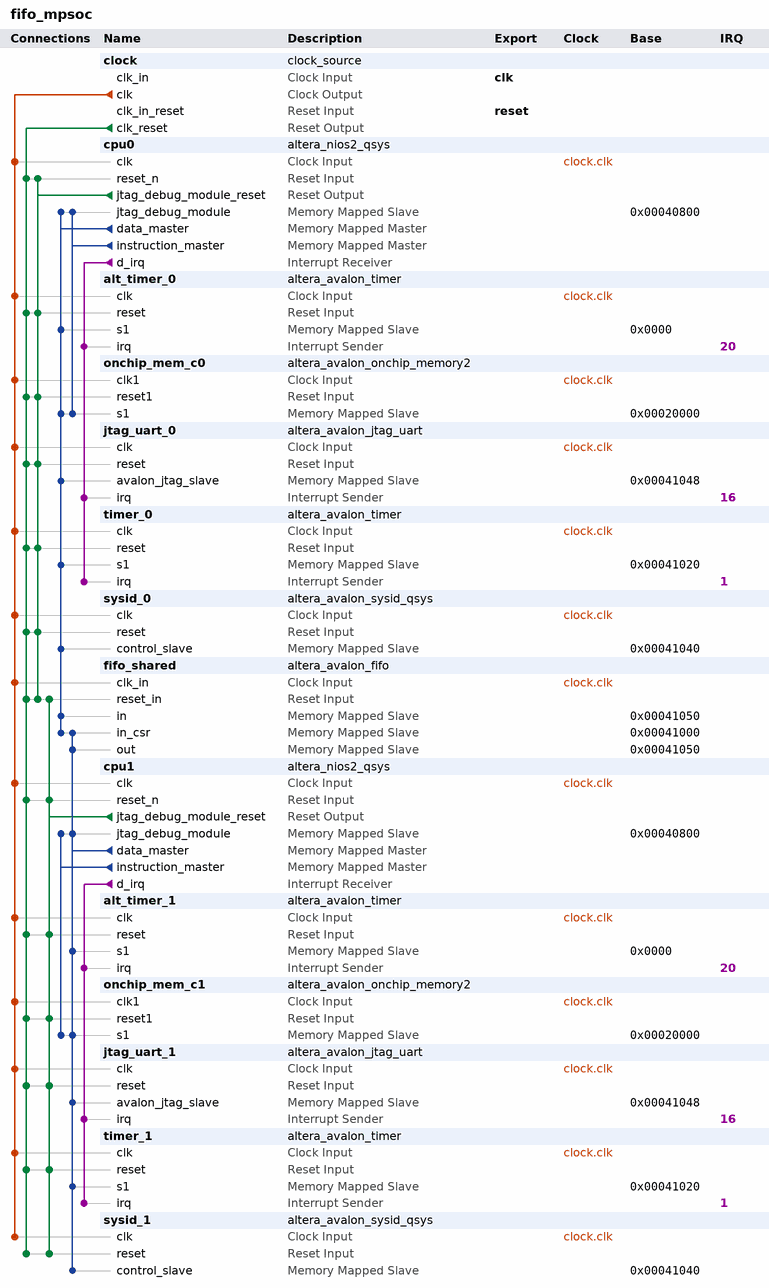
[diagram p0: system contents]
# Platform Designer (Qsys) system fifo_mpsoc, Cyclone IV E EP4CE115F29C7
# Parameters at their usual value, and those the tool derives, are not listed.
package require -exact qsys 13.1
create_system fifo_mpsoc
set_project_property DEVICE_FAMILY {Cyclone IV E}
set_project_property DEVICE EP4CE115F29C7

add_instance clock clock_source 13.1
set_instance_parameter_value clock clockFrequency 50000000

add_instance cpu0 altera_nios2_qsys 13.1
set_instance_parameter_value cpu0 resetSlave onchip_mem_c0.s1
set_instance_parameter_value cpu0 mmu_TLBMissExcSlave None
set_instance_parameter_value cpu0 exceptionSlave onchip_mem_c0.s1
set_instance_parameter_value cpu0 breakSlave cpu0.jtag_debug_module
set_instance_parameter_value cpu0 impl Tiny
set_instance_parameter_value cpu0 icache_size 4096

add_instance alt_timer_0 altera_avalon_timer 13.1
set_instance_parameter_value alt_timer_0 period 1
set_instance_parameter_value alt_timer_0 periodUnits USEC

add_instance onchip_mem_c0 altera_avalon_onchip_memory2 13.1
set_instance_parameter_value onchip_mem_c0 dataWidth 32
set_instance_parameter_value onchip_mem_c0 dualPort false
set_instance_parameter_value onchip_mem_c0 initMemContent true
set_instance_parameter_value onchip_mem_c0 initializationFileName onchip_mem.hex
set_instance_parameter_value onchip_mem_c0 memorySize 131072

add_instance jtag_uart_0 altera_avalon_jtag_uart 13.1
set_instance_parameter_value jtag_uart_0 simInteractiveOptions NO_INTERACTIVE_WINDOWS

add_instance timer_0 altera_avalon_timer 13.1
set_instance_parameter_value timer_0 period 1
set_instance_parameter_value timer_0 periodUnits MSEC

add_instance sysid_0 altera_avalon_sysid_qsys 13.1
set_instance_parameter_value sysid_0 id 192

add_instance fifo_shared altera_avalon_fifo 13.1
set_instance_parameter_value fifo_shared bitsPerSymbol 16
set_instance_parameter_value fifo_shared channelWidth 8
set_instance_parameter_value fifo_shared errorWidth 8
set_instance_parameter_value fifo_shared fifoDepth 32
set_instance_parameter_value fifo_shared fifoInputInterfaceOptions AVALONMM_WRITE
set_instance_parameter_value fifo_shared fifoOutputInterfaceOptions AVALONMM_READ
set_instance_parameter_value fifo_shared singleClockMode true
set_instance_parameter_value fifo_shared symbolsPerBeat 2
set_instance_parameter_value fifo_shared useIRQ false
set_instance_parameter_value fifo_shared usePacket true
set_instance_parameter_value fifo_shared useReadControl false

add_instance cpu1 altera_nios2_qsys 13.1
set_instance_parameter_value cpu1 resetSlave onchip_mem_c1.s1
set_instance_parameter_value cpu1 mmu_TLBMissExcSlave None
set_instance_parameter_value cpu1 exceptionSlave onchip_mem_c1.s1
set_instance_parameter_value cpu1 breakSlave cpu1.jtag_debug_module
set_instance_parameter_value cpu1 impl Tiny
set_instance_parameter_value cpu1 icache_size 4096

add_instance alt_timer_1 altera_avalon_timer 13.1
set_instance_parameter_value alt_timer_1 period 1
set_instance_parameter_value alt_timer_1 periodUnits USEC

add_instance onchip_mem_c1 altera_avalon_onchip_memory2 13.1
set_instance_parameter_value onchip_mem_c1 dataWidth 32
set_instance_parameter_value onchip_mem_c1 dualPort false
set_instance_parameter_value onchip_mem_c1 initMemContent true
set_instance_parameter_value onchip_mem_c1 initializationFileName onchip_mem.hex
set_instance_parameter_value onchip_mem_c1 memorySize 131072

add_instance jtag_uart_1 altera_avalon_jtag_uart 13.1
set_instance_parameter_value jtag_uart_1 simInteractiveOptions NO_INTERACTIVE_WINDOWS

add_instance timer_1 altera_avalon_timer 13.1
set_instance_parameter_value timer_1 period 1
set_instance_parameter_value timer_1 periodUnits MSEC

add_instance sysid_1 altera_avalon_sysid_qsys 13.1
set_instance_parameter_value sysid_1 id 193

# connections
add_connection clock.clk alt_timer_0.clk clock
add_connection clock.clk alt_timer_1.clk clock
add_connection clock.clk cpu0.clk clock
add_connection clock.clk cpu1.clk clock
add_connection clock.clk fifo_shared.clk_in clock
add_connection clock.clk jtag_uart_0.clk clock
add_connection clock.clk jtag_uart_1.clk clock
add_connection clock.clk onchip_mem_c0.clk1 clock
add_connection clock.clk onchip_mem_c1.clk1 clock
add_connection clock.clk sysid_0.clk clock
add_connection clock.clk sysid_1.clk clock
add_connection clock.clk timer_0.clk clock
add_connection clock.clk timer_1.clk clock
add_connection clock.clk_reset alt_timer_0.reset reset
add_connection clock.clk_reset alt_timer_1.reset reset
add_connection clock.clk_reset cpu0.reset_n reset
add_connection clock.clk_reset cpu1.reset_n reset
add_connection clock.clk_reset fifo_shared.reset_in reset
add_connection clock.clk_reset jtag_uart_0.reset reset
add_connection clock.clk_reset jtag_uart_1.reset reset
add_connection clock.clk_reset onchip_mem_c0.reset1 reset
add_connection clock.clk_reset onchip_mem_c1.reset1 reset
add_connection clock.clk_reset sysid_0.reset reset
add_connection clock.clk_reset sysid_1.reset reset
add_connection clock.clk_reset timer_0.reset reset
add_connection clock.clk_reset timer_1.reset reset
add_connection cpu0.jtag_debug_module_reset alt_timer_0.reset reset
add_connection cpu0.jtag_debug_module_reset cpu0.reset_n reset
add_connection cpu0.jtag_debug_module_reset fifo_shared.reset_in reset
add_connection cpu0.jtag_debug_module_reset jtag_uart_0.reset reset
add_connection cpu0.jtag_debug_module_reset onchip_mem_c0.reset1 reset
add_connection cpu0.jtag_debug_module_reset sysid_0.reset reset
add_connection cpu0.jtag_debug_module_reset timer_0.reset reset
add_connection cpu1.jtag_debug_module_reset alt_timer_1.reset reset
add_connection cpu1.jtag_debug_module_reset cpu1.reset_n reset
add_connection cpu1.jtag_debug_module_reset fifo_shared.reset_in reset
add_connection cpu1.jtag_debug_module_reset jtag_uart_1.reset reset
add_connection cpu1.jtag_debug_module_reset onchip_mem_c1.reset1 reset
add_connection cpu1.jtag_debug_module_reset sysid_1.reset reset
add_connection cpu1.jtag_debug_module_reset timer_1.reset reset
add_connection cpu0.data_master alt_timer_0.s1 avalon
set_connection_parameter_value cpu0.data_master/alt_timer_0.s1 baseAddress 0x0000
add_connection cpu0.data_master cpu0.jtag_debug_module avalon
set_connection_parameter_value cpu0.data_master/cpu0.jtag_debug_module baseAddress 0x00040800
add_connection cpu0.data_master fifo_shared.in avalon
set_connection_parameter_value cpu0.data_master/fifo_shared.in baseAddress 0x00041050
add_connection cpu0.data_master fifo_shared.in_csr avalon
set_connection_parameter_value cpu0.data_master/fifo_shared.in_csr baseAddress 0x00041000
add_connection cpu0.data_master jtag_uart_0.avalon_jtag_slave avalon
set_connection_parameter_value cpu0.data_master/jtag_uart_0.avalon_jtag_slave baseAddress 0x00041048
add_connection cpu0.data_master onchip_mem_c0.s1 avalon
set_connection_parameter_value cpu0.data_master/onchip_mem_c0.s1 baseAddress 0x00020000
add_connection cpu0.data_master sysid_0.control_slave avalon
set_connection_parameter_value cpu0.data_master/sysid_0.control_slave baseAddress 0x00041040
add_connection cpu0.data_master timer_0.s1 avalon
set_connection_parameter_value cpu0.data_master/timer_0.s1 baseAddress 0x00041020
add_connection cpu0.instruction_master cpu0.jtag_debug_module avalon
set_connection_parameter_value cpu0.instruction_master/cpu0.jtag_debug_module baseAddress 0x00040800
add_connection cpu0.instruction_master onchip_mem_c0.s1 avalon
set_connection_parameter_value cpu0.instruction_master/onchip_mem_c0.s1 baseAddress 0x00020000
add_connection cpu1.data_master alt_timer_1.s1 avalon
set_connection_parameter_value cpu1.data_master/alt_timer_1.s1 baseAddress 0x0000
add_connection cpu1.data_master cpu1.jtag_debug_module avalon
set_connection_parameter_value cpu1.data_master/cpu1.jtag_debug_module baseAddress 0x00040800
add_connection cpu1.data_master fifo_shared.in_csr avalon
set_connection_parameter_value cpu1.data_master/fifo_shared.in_csr baseAddress 0x00041000
add_connection cpu1.data_master fifo_shared.out avalon
set_connection_parameter_value cpu1.data_master/fifo_shared.out baseAddress 0x00041050
add_connection cpu1.data_master jtag_uart_1.avalon_jtag_slave avalon
set_connection_parameter_value cpu1.data_master/jtag_uart_1.avalon_jtag_slave baseAddress 0x00041048
add_connection cpu1.data_master onchip_mem_c1.s1 avalon
set_connection_parameter_value cpu1.data_master/onchip_mem_c1.s1 baseAddress 0x00020000
add_connection cpu1.data_master sysid_1.control_slave avalon
set_connection_parameter_value cpu1.data_master/sysid_1.control_slave baseAddress 0x00041040
add_connection cpu1.data_master timer_1.s1 avalon
set_connection_parameter_value cpu1.data_master/timer_1.s1 baseAddress 0x00041020
add_connection cpu1.instruction_master cpu1.jtag_debug_module avalon
set_connection_parameter_value cpu1.instruction_master/cpu1.jtag_debug_module baseAddress 0x00040800
add_connection cpu1.instruction_master onchip_mem_c1.s1 avalon
set_connection_parameter_value cpu1.instruction_master/onchip_mem_c1.s1 baseAddress 0x00020000
add_connection cpu0.d_irq alt_timer_0.irq interrupt
set_connection_parameter_value cpu0.d_irq/alt_timer_0.irq irqNumber 20
add_connection cpu0.d_irq jtag_uart_0.irq interrupt
set_connection_parameter_value cpu0.d_irq/jtag_uart_0.irq irqNumber 16
add_connection cpu0.d_irq timer_0.irq interrupt
set_connection_parameter_value cpu0.d_irq/timer_0.irq irqNumber 1
add_connection cpu1.d_irq alt_timer_1.irq interrupt
set_connection_parameter_value cpu1.d_irq/alt_timer_1.irq irqNumber 20
add_connection cpu1.d_irq jtag_uart_1.irq interrupt
set_connection_parameter_value cpu1.d_irq/jtag_uart_1.irq irqNumber 16
add_connection cpu1.d_irq timer_1.irq interrupt
set_connection_parameter_value cpu1.d_irq/timer_1.irq irqNumber 1

# exported interfaces
add_interface clk clock sink
set_interface_property clk EXPORT_OF clock.clk_in
add_interface reset reset sink
set_interface_property reset EXPORT_OF clock.clk_in_reset

set_interconnect_requirement {$system} qsys_mm.clockCrossingAdapter HANDSHAKE
set_interconnect_requirement {$system} qsys_mm.maxAdditionalLatency 1
set_interconnect_requirement {$system} qsys_mm.insertDefaultSlave false

save_system fifo_mpsoc.qsys
